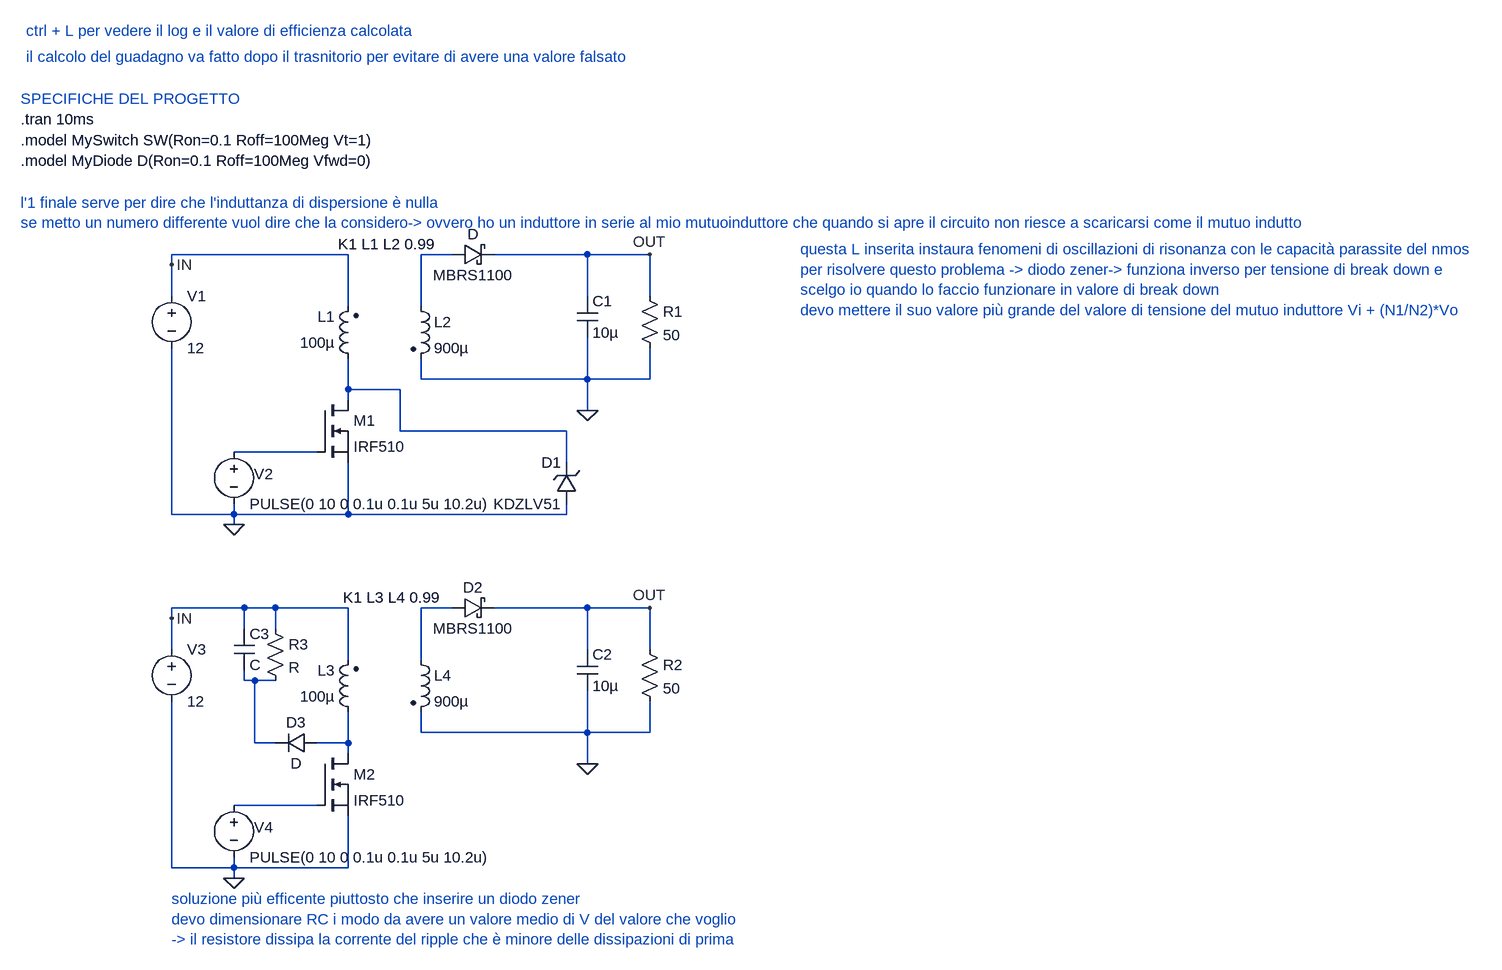
[diagram p0: schematic flyback.asc]
flyback.asc, the LTspice schematic file:
Version 4
SHEET 1 1372 1144
WIRE -1008 80 -1280 80
WIRE -848 80 -896 80
WIRE -640 80 -784 80
WIRE -544 80 -640 80
WIRE -1280 96 -1280 80
WIRE -1280 144 -1280 96
WIRE -640 144 -640 80
WIRE -544 144 -544 80
WIRE -1008 160 -1008 80
WIRE -896 160 -896 80
WIRE -896 272 -896 240
WIRE -640 272 -640 208
WIRE -640 272 -896 272
WIRE -544 272 -544 224
WIRE -544 272 -640 272
WIRE -1008 288 -1008 240
WIRE -928 288 -1008 288
WIRE -1008 304 -1008 288
WIRE -640 320 -640 272
WIRE -928 352 -928 288
WIRE -672 352 -928 352
WIRE -1056 384 -1184 384
WIRE -672 400 -672 352
WIRE -1280 480 -1280 224
WIRE -1184 480 -1184 464
WIRE -1184 480 -1280 480
WIRE -1008 480 -1008 400
WIRE -1008 480 -1184 480
WIRE -672 480 -672 464
WIRE -672 480 -1008 480
WIRE -1184 496 -1184 480
WIRE -1168 624 -1280 624
WIRE -1120 624 -1168 624
WIRE -1008 624 -1120 624
WIRE -848 624 -896 624
WIRE -640 624 -784 624
WIRE -544 624 -640 624
WIRE -1280 640 -1280 624
WIRE -1168 656 -1168 624
WIRE -1120 656 -1120 624
WIRE -1280 688 -1280 640
WIRE -640 688 -640 624
WIRE -544 688 -544 624
WIRE -1008 704 -1008 624
WIRE -896 704 -896 624
WIRE -1168 736 -1168 720
WIRE -1152 736 -1168 736
WIRE -1120 736 -1152 736
WIRE -896 816 -896 784
WIRE -640 816 -640 752
WIRE -640 816 -896 816
WIRE -544 816 -544 768
WIRE -544 816 -640 816
WIRE -1152 832 -1152 736
WIRE -1120 832 -1152 832
WIRE -1008 832 -1008 784
WIRE -1008 832 -1056 832
WIRE -1008 848 -1008 832
WIRE -640 864 -640 816
WIRE -1056 928 -1184 928
WIRE -1280 1024 -1280 768
WIRE -1184 1024 -1184 1008
WIRE -1184 1024 -1280 1024
WIRE -1008 1024 -1008 944
WIRE -1008 1024 -1184 1024
WIRE -1184 1040 -1184 1024
FLAG -1184 496 0
FLAG -544 80 OUT
FLAG -1280 96 IN
FLAG -640 320 0
FLAG -1184 1040 0
FLAG -544 624 OUT
FLAG -1280 640 IN
FLAG -640 864 0
SYMBOL cap -656 144 R0
SYMATTR InstName C1
SYMATTR Value 10µ
SYMBOL ind2 -992 256 R180
WINDOW 0 36 80 Left 2
WINDOW 3 36 40 Left 2
SYMATTR InstName L1
SYMATTR Value 100µ
SYMATTR Type ind
SYMBOL res -560 128 R0
SYMATTR InstName R1
SYMATTR Value 50
SYMBOL voltage -1280 128 R0
WINDOW 123 0 0 Left 0
WINDOW 39 0 0 Left 0
SYMATTR InstName V1
SYMATTR Value 12
SYMBOL voltage -1184 368 R0
WINDOW 123 0 0 Left 0
WINDOW 39 0 0 Left 0
WINDOW 0 31 50 Left 2
SYMATTR InstName V2
SYMATTR Value PULSE(0 10 0 0.1u 0.1u 5u 10.2u)
SYMBOL ind2 -912 144 R0
SYMATTR InstName L2
SYMATTR Value 900µ
SYMATTR Type ind
SYMBOL schottky -848 96 R270
WINDOW 0 32 32 VTop 2
WINDOW 3 0 32 VBottom 2
SYMATTR InstName D
SYMATTR Value MBRS1100
SYMBOL nmos -1056 304 R0
SYMATTR InstName M1
SYMATTR Value IRF510
SYMBOL zener -656 464 R180
WINDOW 0 24 64 Left 2
WINDOW 3 24 0 Left 2
SYMATTR InstName D1
SYMATTR Value KDZLV51
SYMBOL cap -656 688 R0
SYMATTR InstName C2
SYMATTR Value 10µ
SYMBOL ind2 -992 800 R180
WINDOW 0 36 80 Left 2
WINDOW 3 36 40 Left 2
SYMATTR InstName L3
SYMATTR Value 100µ
SYMATTR Type ind
SYMBOL res -560 672 R0
SYMATTR InstName R2
SYMATTR Value 50
SYMBOL voltage -1280 672 R0
WINDOW 123 0 0 Left 0
WINDOW 39 0 0 Left 0
SYMATTR InstName V3
SYMATTR Value 12
SYMBOL voltage -1184 912 R0
WINDOW 123 0 0 Left 0
WINDOW 39 0 0 Left 0
WINDOW 0 31 50 Left 2
SYMATTR InstName V4
SYMATTR Value PULSE(0 10 0 0.1u 0.1u 5u 10.2u)
SYMBOL ind2 -912 688 R0
SYMATTR InstName L4
SYMATTR Value 900µ
SYMATTR Type ind
SYMBOL schottky -848 640 R270
WINDOW 0 32 32 VTop 2
WINDOW 3 0 32 VBottom 2
SYMATTR InstName D2
SYMATTR Value MBRS1100
SYMBOL nmos -1056 848 R0
SYMATTR InstName M2
SYMATTR Value IRF510
SYMBOL cap -1184 656 R0
SYMATTR InstName C3
SYMBOL res -1136 640 R0
SYMATTR InstName R3
SYMBOL diode -1056 816 R90
WINDOW 0 0 32 VBottom 2
WINDOW 3 32 32 VTop 2
SYMATTR InstName D3
TEXT -1512 -128 Left 2 !.tran 10ms
TEXT -1512 -96 Left 2 !.model MySwitch SW(Ron=0.1 Roff=100Meg Vt=1)
TEXT -1512 -64 Left 2 !.model MyDiode D(Ron=0.1 Roff=100Meg Vfwd=0)
TEXT -1512 -160 Left 2 ;SPECIFICHE DEL PROGETTO
TEXT -1504 -264 Left 2 ;ctrl + L per vedere il log e il valore di efficienza calcolata
TEXT -1504 -224 Left 2 ;il calcolo del guadagno va fatto dopo il trasnitorio per evitare di avere una valore falsato
TEXT -1024 64 Left 2 !K1 L1 L2 0.99
TEXT -1512 0 Left 2 ;l'1 finale serve per dire che l'induttanza di dispersione è nulla\nse metto un numero differente vuol dire che la considero-> ovvero ho un induttore in serie al mio mutuoinduttore che quando si apre il circuito non riesce a scaricarsi come il mutuo indutto
TEXT -312 72 Left 2 ;questa L inserita instaura fenomeni di oscillazioni di risonanza con le capacità parassite del nmos \nper risolvere questo problema -> diodo zener-> funziona inverso per tensione di break down e \nscelgo io quando lo faccio funzionare in valore di break down\ndevo mettere il suo valore più grande del valore di tensione del mutuo induttore Vi + (N1/N2)*Vo
TEXT -1016 608 Left 2 !K1 L3 L4 0.99
TEXT -1280 1072 Left 2 ;soluzione più efficente piuttosto che inserire un diodo zener\ndevo dimensionare RC i modo da avere un valore medio di V del valore che voglio\n-> il resistore dissipa la corrente del ripple che è minore delle dissipazioni di prima

The netlist it stands for:
* flyback.asc
C1 OUT 0 10µ
L1 N002 IN 100µ
R1 OUT 0 50
V1 IN 0 12
V2 N003 0 PULSE(0 10 0 0.1u 0.1u 5u 10.2u)
L2 N001 0 900µ
D N001 OUT MBRS1100
M1 N002 N003 0 0 IRF510
D1 0 N002 KDZLV51
C2 OUT 0 10µ
L3 N006 IN 100µ
R2 OUT 0 50
V3 IN 0 12
V4 N007 0 PULSE(0 10 0 0.1u 0.1u 5u 10.2u)
L4 N004 0 900µ
D2 N004 OUT MBRS1100
M2 N006 N007 0 0 IRF510
C3 IN N005 C
R3 IN N005 R
D3 N006 N005 D
.model D D
.lib standard.dio
.model NMOS NMOS
.model PMOS PMOS
.lib standard.mos
.tran 10ms
.model MySwitch SW(Ron=0.1 Roff=100Meg Vt=1)
.model MyDiode D(Ron=0.1 Roff=100Meg Vfwd=0)
* SPECIFICHE DEL PROGETTO
* ctrl + L per vedere il log e il valore di efficienza calcolata
* il calcolo del guadagno va fatto dopo il trasnitorio per evitare di avere una valore falsato
K1 L1 L2 0.99
* l'1 finale serve per dire che l'induttanza di dispersione è nulla
* se metto un numero differente vuol dire che la considero-> ovvero ho un induttore in serie al mio mutuoinduttore che quando si apre il circuito non riesce a scaricarsi come il mutuo indutto
* questa L inserita instaura fenomeni di oscillazioni di risonanza con le capacità parassite del nmos
* per risolvere questo problema -> diodo zener-> funziona inverso per tensione di break down e
* scelgo io quando lo faccio funzionare in valore di break down
* devo mettere il suo valore più grande del valore di tensione del mutuo induttore Vi + (N1/N2)*Vo
K1 L3 L4 0.99
* soluzione più efficente piuttosto che inserire un diodo zener
* devo dimensionare RC i modo da avere un valore medio di V del valore che voglio
* -> il resistore dissipa la corrente del ripple che è minore delle dissipazioni di prima
.backanno
.end